# Altium schematic sheet power.SchDoc
size A2; SPICEModelCacheUWPXBFBI: <root> / <DocumentId>UWPXBFBI</DocumentId> / </root>
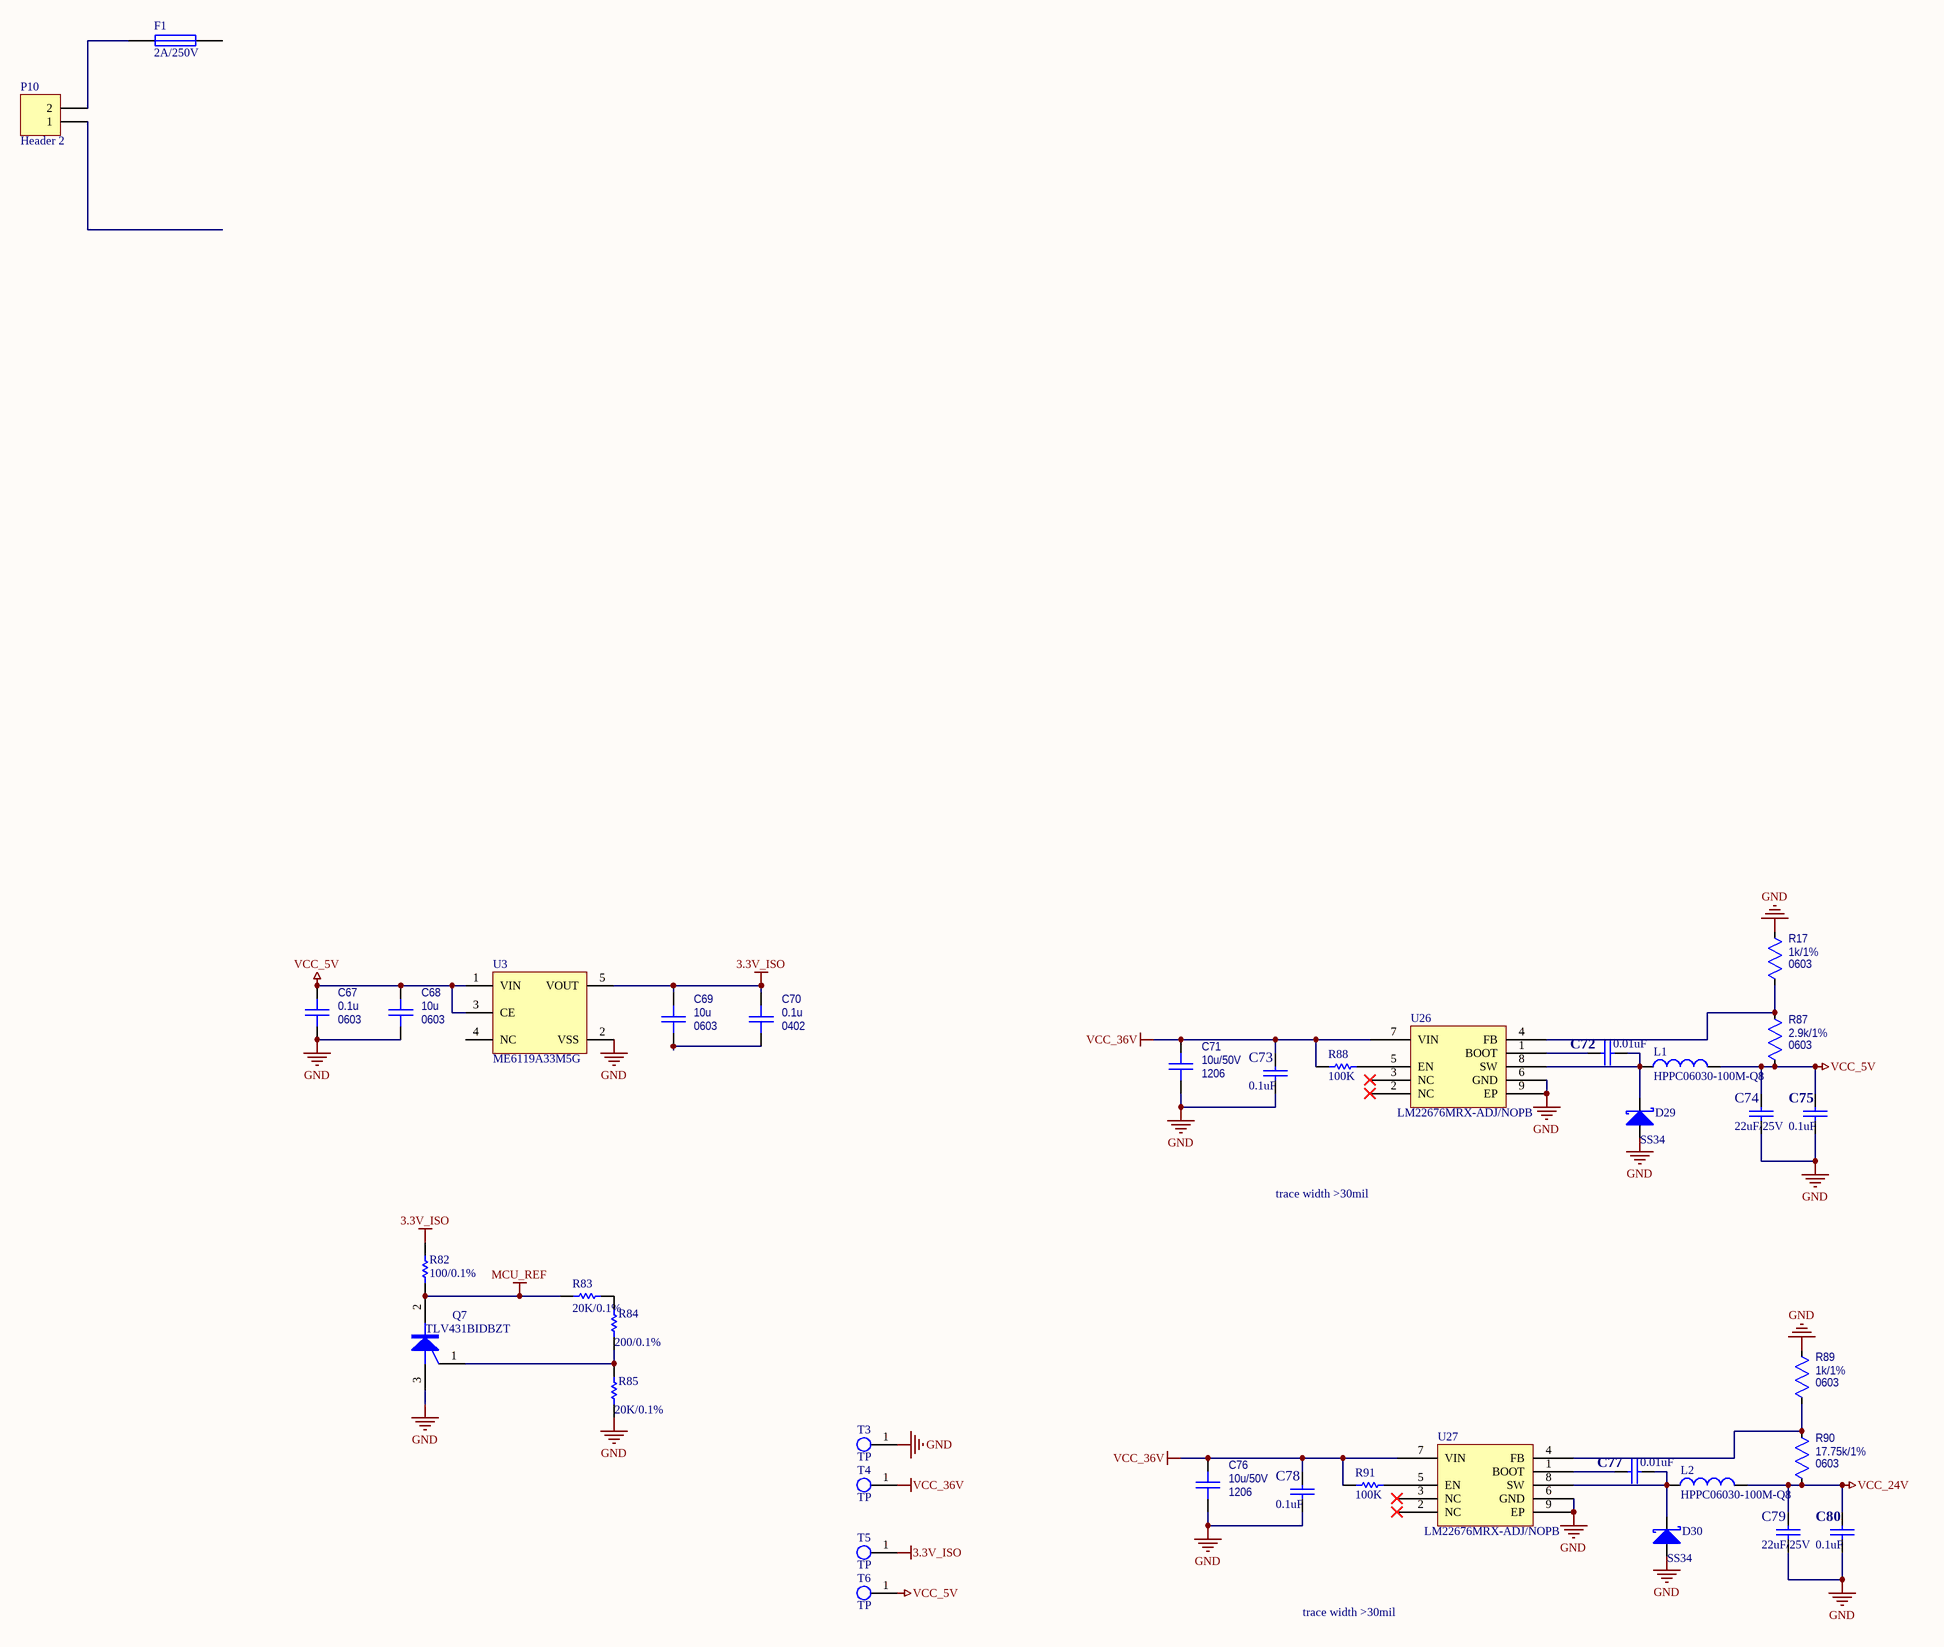
[diagram p0: power.SchDoc]

## Parts
C67  value 0.1u  Package: 0603  [CAPC1608X092N_0603]  (hidden comment: Capacitor_0603)
C68  value 10u  Package: 0603  [CAPC1608X092N_0603]  (hidden comment: Capacitor_0603)
C69  value 10u  Package: 0603  [CAPC1608X092N_0603]  (hidden comment: Capacitor_0603)
C70  value 0.1u  Package: 0402  [CAPC1005X056N_0402]  (hidden comment: Capacitor_0402)
C71  value 10u/50V  Package: 1206  [1206C]  (hidden comment: Capacitor_1206)
C72  0.01uF  [0603C]
C73  0.1uF  [0603C]
C74  22uF/25V  [1206C]
C75  0.1uF  [0603C]
C76  value 10u/50V  Package: 1206  [1206C]  (hidden comment: Capacitor_1206)
C77  0.01uF  [0603C]
C78  0.1uF  [0603C]
C79  22uF/25V  [1206C]
C80  0.1uF  [0603C]
D29  SS34  [SMA]
D30  SS34  [SMA]
F1  2A/250V  [可视开关电源保险丝座]
L1  HPPC06030-100M-Q8  [IND-SMD-L7.3-W6]
L2  HPPC06030-100M-Q8  [IND-SMD-L7.3-W6]
P10  Header 2  [HDR1X2]
Q7  TLV431BIDBZT  [SOT23-3]
R17  value 1k/1%  Package: 0603  [0603R]  (hidden comment: Resistor_0603)
R82  100/0.1%  [0603R]
R83  value 20K/0.1%  [0603R]  (hidden comment: 1K/0.1%)
R84  value 200/0.1%  [0603R]  (hidden comment: 1K/0.1%)
R85  value 20K/0.1%  [0603R]  (hidden comment: 1K/0.1%)
R87  value 2.9k/1%  Package: 0603  [0603R]  (hidden comment: Resistor_0603)
R88  100K  [0603R]
R89  value 1k/1%  Package: 0603  [0603R]  (hidden comment: Resistor_0603)
R90  value 17.75k/1%  Package: 0603  [0603R]  (hidden comment: Resistor_0603)
R91  100K  [0603R]
T3  TP  [TPD]
T4  TP  [TPD]
T5  TP  [TPD]
T6  TP  [TPD]
U3  ME6119A33M5G  [MCRN-SOT23-5_V]
U26  LM22676MRX-ADJ/NOPB  [SOP127P600X168_HS-8N]
U27  LM22676MRX-ADJ/NOPB  [SOP127P600X168_HS-8N]

## Nets
3.3V_ISO: C69.1 C70.1 R82.1 T5.1 U3.5(VOUT)
GND: C67.2 C68.2 C71.2 C73.1 C74.1 C75.2 C76.2 C78.1 C79.1 C80.2 D29.1(A) D30.1(A) Q7.3(A) R17.2 R85.2 R89.2 T3.1 U3.2(VSS) U26.6(GND) U26.9(EP) U27.6(GND) U27.9(EP)
MCU_REF: Q7.2(K) R82.2 R83.1
VCC_5V: C67.1 C68.1 C74.2 C75.1 L1.2 R87.1 T6.1 U3.1(VIN) U3.3(CE)
VCC_24V: C79.2 C80.1 L2.2 R90.1
VCC_36V: C71.1 C73.2 C76.1 C78.2 R88.2 R91.2 T4.1 U26.7(VIN) U27.7(VIN)
NetC69_2: C69.2 C70.2
NetC72_1: C72.1 D29.2(K) L1.1 U26.8(SW)
NetC72_2: C72.2 U26.1(BOOT)
NetC77_1: C77.1 D30.2(K) L2.1 U27.8(SW)
NetC77_2: C77.2 U27.1(BOOT)
NetF1_1: F1.1 P10.2
NetQ7_1: Q7.1(G) R84.2 R85.1
NetR17_1: R17.1 R87.2 U26.4(FB)
NetR83_2: R83.2 R84.1
NetR88_1: R88.1 U26.5(EN)
NetR89_1: R89.1 R90.2 U27.4(FB)
NetR91_1: R91.1 U27.5(EN)

Not connected (* = marked no-connect by the designer): F1 2; P10 1; U3 4(NC); U26 2(NC)* 3(NC)*; U27 2(NC)* 3(NC)*

## Notes on the sheet
- trace width >30mil

## Library data of the parts
C67 = Capacitor_0603: Capacitor, MLCC; Manufacturer: KEMET; PartNumber: C0603C104M5RACTU; Tolerance: [tol]; TempCo: [tempco]; Voltage Rating: [voltage]; ComponentLink1URL: *; Current Rating: *; ComponentLink1Description: Datasheet; Power Rating: *; SupplierDescription: CAP CER 0.1UF 50V X7R 0603
C68 C69 = Capacitor_0603: Capacitor, MLCC; Manufacturer: Murata Electronics; PartNumber: GRM188R61A106KE69D; Tolerance: [tol]; TempCo: [tempco]; Voltage Rating: [voltage]; Supplier 1: *; ComponentLink1URL: *; Supplier Part Number 1: *; ComponentLink1Description: Datasheet; SupplierDescription: CAP CER 10UF 10V X5R 0603
C70 = Capacitor_0402: Capacitor, MLCC; Manufacturer: Murata Electronics; PartNumber: GRM155R71C104KA88J; Tolerance: [tol]; TempCo: [tempco]; Voltage Rating: [voltage]; Supplier 1: *; ComponentLink1URL: *; Supplier Part Number 1: *; ComponentLink1Description: Datasheet; SupplierDescription: CAP CER 0.1UF 16V X7R 0402
C71 C76 = Capacitor_1206: PartNumber: C1206C106M3PACTU; Tolerance: [tol]; TempCo: [tempco]; Voltage Rating: [voltage]; Power Rating: *; SupplierDescription: CAP CER 10UF 25V X5R 1206
C72 C77 = CAP: Value: 0.01u/50V
C73 C75 C78 C80 = CAP: Value: 0.1uF/50V
C74 C79 = CAP: Value: 22uF/25V
D29 D30 = DIODE S: Value: SS34
F1 = Fuse 1: Fuse; Published: 8-Jun-2000; LatestRevisionDate: 17-Jul-2002; LatestRevisionNote: Re-released for DXP Platform.; PackageReference: PIN-W2/E2.8; Publisher: Altium Limited; PackageDescription: Thru-Hole; 2 Leads
L1 L2 = 1276AS-H-100M=P2: Rated Current: 250 mA; Mounting Technology: Surface Mount; PackageDescription: 2-Pin SMT Inductor, 3.2 x 2.5 mm Body; PackageReference: IND1210; PartNumber: 1276AS-H-100M=P2; Value: HPPC06030-100M-Q8
P10 = Header 2: Header, 2-Pin; LatestRevisionDate: 17-Jul-2002; LatestRevisionNote: Re-released for DXP Platform.; Publisher: Altium Limited
Q7 = PUT: Programmable Unijunction Transistor; Published: 8-Jun-2000; LatestRevisionDate: 17-Jul-2002; LatestRevisionNote: Re-released for DXP Platform.; PackageReference: TO-52; Publisher: Altium Limited
R17 R87 R89 R90 = Resistor_0603: PartNumber: RC0603FR-1075KL; Power Rating: [power]; TempCo: [tempco]; Tolerance: tol; SupplierDescription: RES SMD 75K OHM 1% 1/10W 0603
R82-R85 = Res1: Resistor; Published: 8-Jun-2000; LatestRevisionDate: 17-Jul-2002; LatestRevisionNote: Re-released for DXP Platform.; PackageReference: AXIAL-0.3; Publisher: Altium Limited
R88 R91 = Res1: Published: 8-Jun-2000; PackageReference: AXIAL-0.3; Publisher: Altium Limited; Value: 100K
U3 = ME6119C50M5G: High Speed LDO Regulators, Low ESR, 5.0 V, 400 mA, -40 to 125 degC, 5-Pin SOT-23, RoHS, Tape and Reel; Number of Regulators: 1; Dropout Voltage: 160mV; Output Current: 300mA; Min Input Voltage: 2.5V; Nominal Output Voltage: 3.3V; Max Input Voltage: 5.5V; Min Current Limit: 400mA; Number of Pins: 5; RoHSCompliant: True; Min Operating Temperature: -40degC; Case\/Package: SOT-23; Datasheet URL: http://ww1.microchip.com/downloads/en/DeviceDoc/MIC550X.pdf; Package Description: 5-Pin Small Outline Transistor, Body 1.6 x 2.9 mm, Pitch 0.95 mm; Max Operating Temperature: 125degC; Packaging: CutTape; Manufacturer URL: http://www.microchip.com/; Package Reference: SOT-23; Mount: SurfaceMount; Output Voltage: 3.3V; Mounting Technology: SurfaceMount; Lead Free: LeadFree; REACH SVHC: NoSVHC; Datasheet Version: Rev. 2.3, 04/2015
U26 U27 = LM22676MR-5.0: Value: LM22676MRE-5.0/NOPB